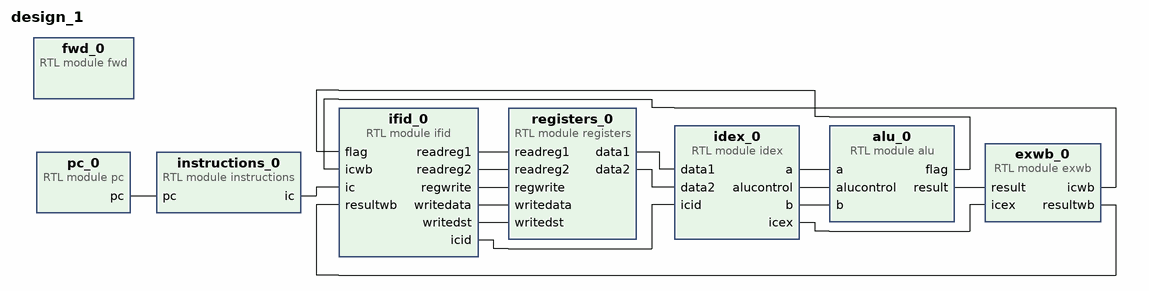
[diagram p0: block diagram of the top level]
# Vivado block design design_1, xc7k70tfbv676-1, Vivado 2024.1
create_bd_design design_1

create_bd_cell -type module -reference pc pc_0
create_bd_cell -type module -reference instructions instructions_0
create_bd_cell -type module -reference ifid ifid_0
create_bd_cell -type module -reference registers registers_0
create_bd_cell -type module -reference idex idex_0
create_bd_cell -type module -reference alu alu_0
create_bd_cell -type module -reference exwb exwb_0
create_bd_cell -type module -reference fwd fwd_0

# ---- connections ----

connect_bd_net [get_bd_pins alu_0/flag] [get_bd_pins ifid_0/flag]
connect_bd_net [get_bd_pins alu_0/result] [get_bd_pins exwb_0/result]
connect_bd_net [get_bd_pins exwb_0/icwb] [get_bd_pins ifid_0/icwb]
connect_bd_net [get_bd_pins exwb_0/resultwb] [get_bd_pins ifid_0/resultwb]
connect_bd_net [get_bd_pins idex_0/a] [get_bd_pins alu_0/a]
connect_bd_net [get_bd_pins idex_0/alucontrol] [get_bd_pins alu_0/alucontrol]
connect_bd_net [get_bd_pins idex_0/b] [get_bd_pins alu_0/b]
connect_bd_net [get_bd_pins idex_0/icex] [get_bd_pins exwb_0/icex]
connect_bd_net [get_bd_pins ifid_0/icid] [get_bd_pins idex_0/icid]
connect_bd_net [get_bd_pins ifid_0/readreg1] [get_bd_pins registers_0/readreg1]
connect_bd_net [get_bd_pins ifid_0/readreg2] [get_bd_pins registers_0/readreg2]
connect_bd_net [get_bd_pins ifid_0/regwrite] [get_bd_pins registers_0/regwrite]
connect_bd_net [get_bd_pins ifid_0/writedata] [get_bd_pins registers_0/writedata]
connect_bd_net [get_bd_pins ifid_0/writedst] [get_bd_pins registers_0/writedst]
connect_bd_net [get_bd_pins instructions_0/ic] [get_bd_pins ifid_0/ic]
connect_bd_net [get_bd_pins pc_0/pc] [get_bd_pins instructions_0/pc]
connect_bd_net [get_bd_pins registers_0/data1] [get_bd_pins idex_0/data1]
connect_bd_net [get_bd_pins registers_0/data2] [get_bd_pins idex_0/data2]

validate_bd_design
save_bd_design
